# EAGLE design buffer (EAGLE 6.4)
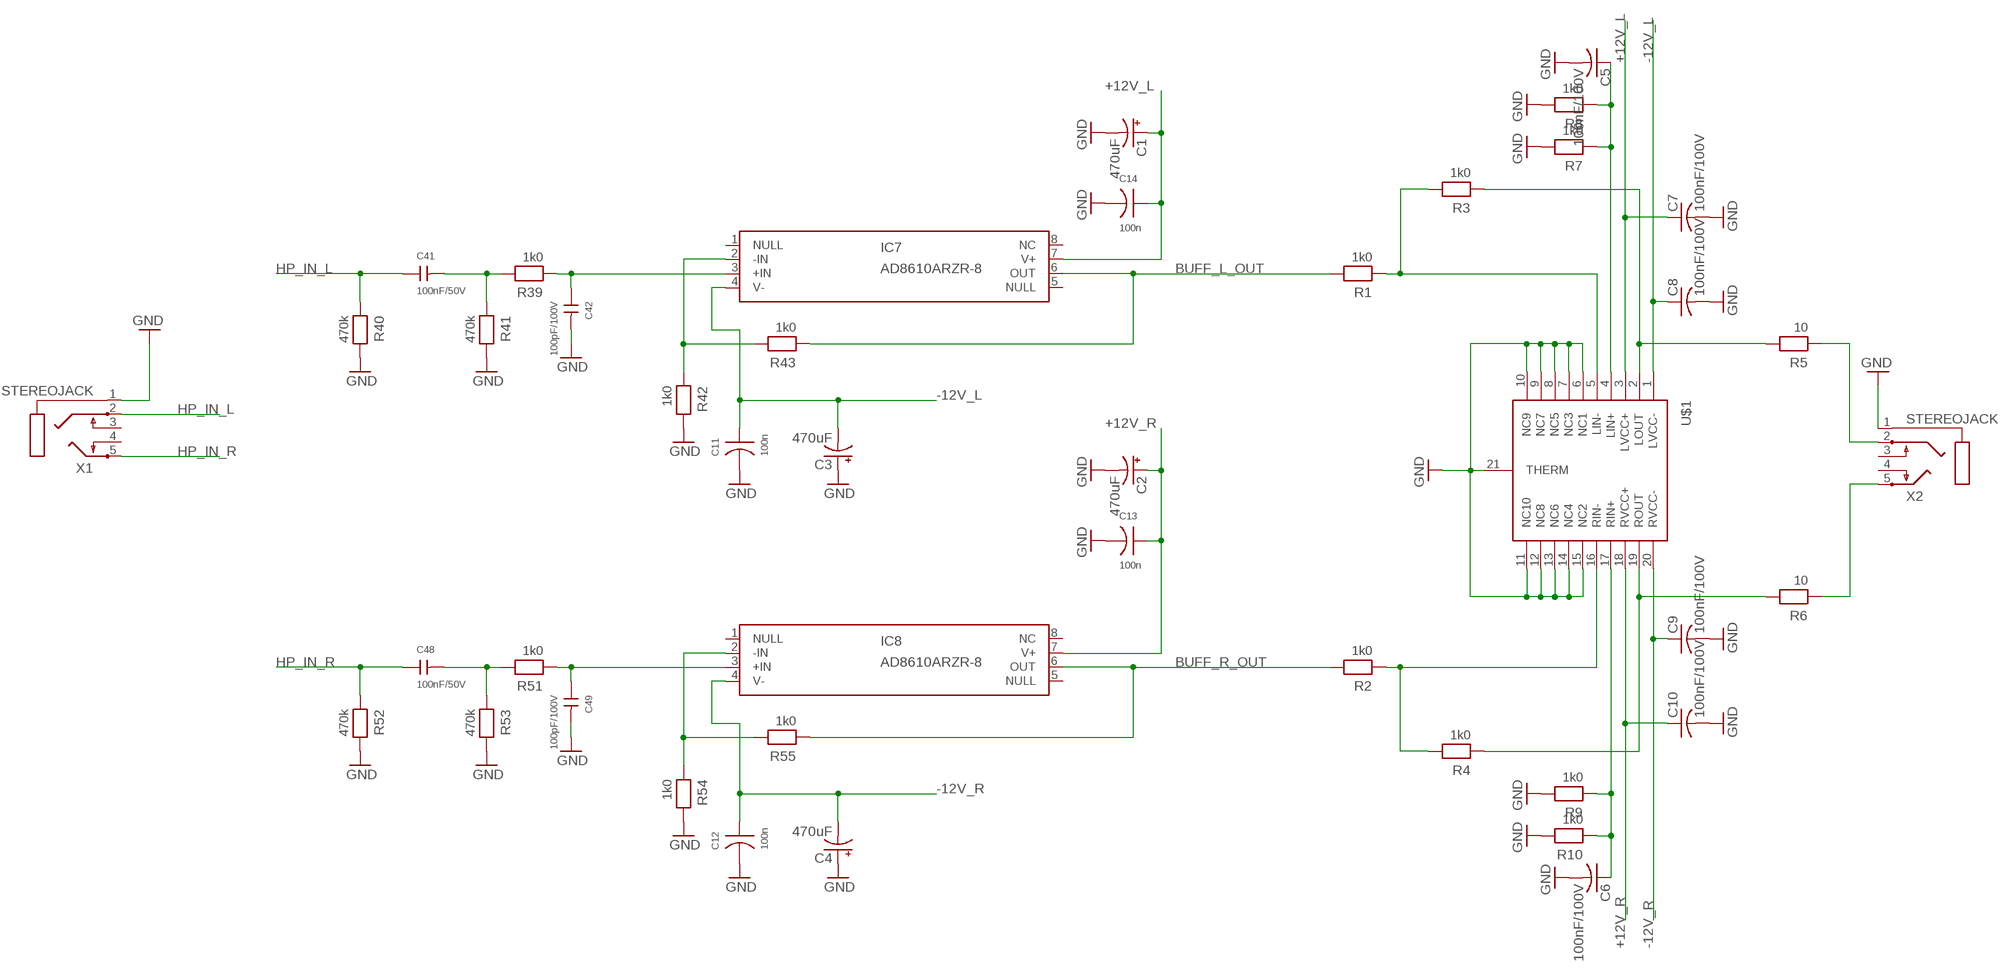
[diagram p0: schematic, sheet 1]

## Parts
C1  470uF  CPOL-USE5-13  [E5-13]
C2  470uF  CPOL-USE5-13  [E5-13]
C3  470uF  CPOL-USE5-13  [E5-13]
C4  470uF  CPOL-USE5-13  [E5-13]
C5  100nF/100V  C-USC0402  [C0402]
C6  100nF/100V  C-USC0402  [C0402]
C7  100nF/100V  C-USC0402  [C0402]
C8  100nF/100V  C-USC0402  [C0402]
C9  100nF/100V  C-USC0402  [C0402]
C10  100nF/100V  C-USC0402  [C0402]
C11  100n  PCAP0603LEVEL3  [R0603]
C12  100n  PCAP0603LEVEL3  [R0603]
C13  100n  PCAP0603LEVEL3  [R0603]
C14  100n  PCAP0603LEVEL3  [R0603]
C41  100nF/50V  100NF63VMKS2  [2,5X6,5RM5,0]
C42  100pF/100V  100PF100VFKC02  [2,5X7,0RM2,5]
C48  100nF/50V  100NF63VMKS2  [2,5X6,5RM5,0]
C49  100pF/100V  100PF100VFKC02  [2,5X7,0RM2,5]
IC7  AD8610ARZR-8  [8-LEAD-SOIC_N]
IC8  AD8610ARZR-8  [8-LEAD-SOIC_N]
R1  1k0  PRES0603LEVEL3  [R0603]
R2  1k0  PRES0603LEVEL3  [R0603]
R3  1k0  PRES0603LEVEL3  [R0603]
R4  1k0  PRES0603LEVEL3  [R0603]
R5  10  PRES0805LEVEL3  [R0805]
R6  10  PRES0805LEVEL3  [R0805]
R7  1k0  PRES0603LEVEL3  [R0603]
R8  1k0  PRES0603LEVEL3  [R0603]
R9  1k0  PRES0603LEVEL3  [R0603]
R10  1k0  PRES0603LEVEL3  [R0603]
R39  1k0  PRES0603LEVEL3  [R0603]
R40  470k  PRES0603LEVEL3  [R0603]
R41  470k  PRES0603LEVEL3  [R0603]
R42  1k0  PRES0603LEVEL3  [R0603]
R43  1k0  PRES0603LEVEL3  [R0603]
R51  1k0  PRES0603LEVEL3  [R0603]
R52  470k  PRES0603LEVEL3  [R0603]
R53  470k  PRES0603LEVEL3  [R0603]
R54  1k0  PRES0603LEVEL3  [R0603]
R55  1k0  PRES0603LEVEL3  [R0603]
U$1  TPA6120_TPA6120  [TPA6120_TPA6120]
X1  STEREOJACK  [STX3100]
X2  STEREOJACK  [STX3100]

## Nets
+12V_L: C1.+ C7.1 C14.P$2 IC7.7(V+) U$1.3(LVCC+)
+12V_R: C2.+ C10.1 C13.P$2 IC8.7(V+) U$1.18(RVCC+)
-12V_L: C3.- C8.1 C11.P$2 IC7.4(V-) U$1.1(LVCC-)
-12V_R: C4.- C9.1 C12.P$2 IC8.4(V-) U$1.20(RVCC-)
BUFF_L_OUT: IC7.6(OUT) R1.P$2 R43.P$1
BUFF_R_OUT: IC8.6(OUT) R2.P$2 R55.P$1
GND: C1.- C2.- C3.+ C4.+ C5.2 C6.2 C7.2 C8.2 C9.2 C10.2 C11.P$1 C12.P$1 C13.P$1 C14.P$1 C42.2 C49.2 R7.P$2 R8.P$2 R9.P$2 R10.P$2 R40.P$2 R41.P$2 R42.P$2 R52.P$2 R53.P$2 R54.P$2 U$1.6(NC1) U$1.7(NC3) U$1.8(NC5) U$1.9(NC7) U$1.10(NC9) U$1.11(NC10) U$1.12(NC8) U$1.13(NC6) U$1.14(NC4) U$1.15(NC2) U$1.21(THERM) X1.1 X2.1
HP_IN_L: C41.1 R40.P$1 X1.2
HP_IN_R: C48.1 R52.P$1 X1.5
INVERT_L: R1.P$1 R3.P$2 U$1.5(LIN-)
INVERT_R: R2.P$1 R4.P$2 U$1.16(RIN-)
N$19: C5.1 R7.P$1 R8.P$1 U$1.4(LIN+)
N$20: C6.1 R9.P$1 R10.P$1 U$1.17(RIN+)
N$23: R6.P$1 X2.5
N$24: R5.P$1 X2.2
N$30: C41.2 R39.P$2 R41.P$1
N$31: C42.1 IC7.3(+IN) R39.P$1
N$32: IC7.2(-IN) R42.P$1 R43.P$2
N$39: C48.2 R51.P$2 R53.P$1
N$40: C49.1 IC8.3(+IN) R51.P$1
N$41: IC8.2(-IN) R54.P$1 R55.P$2
OUT_L: R3.P$1 R5.P$2 U$1.2(LOUT)
OUT_R: R4.P$1 R6.P$2 U$1.19(ROUT)
Unconnected: IC7.1(NULL) IC7.5(NULL) IC7.8(NC) IC8.1(NULL) IC8.5(NULL) IC8.8(NC) X1.3 X1.4 X2.3 X2.4

## Library data of the parts
C1-C4 = rcl:CPOL-US: POLARIZED CAPACITOR, American symbol
C5-C10 = rcl:C-US: CAPACITOR, American symbol
C11-C14 = rcl_pro:PCAP0603
C41 C48 = wima_c:100NF63V
C42 C49 = wima_c:100PF100V
IC7 IC8 = ad8610arz:AD8610ARZ: edit this description Auto generated by make-symbol-device-package-bsdl.ulp Rev. 43 Source:
R1-R4 R7-R10 R39-R43 R51-R55 = rcl_pro:PRES0603
R5 R6 = rcl_pro:PRES0805
U$1 = amp:TPA6120_TPA6120
X1 X2 = adafruit:STEREOJACK: MIC/HEADPHONE JACK Stereo jack with two switches. Kycon STX3100, CUI SJ1-3555NG and/or 4UCon 05544

## Board
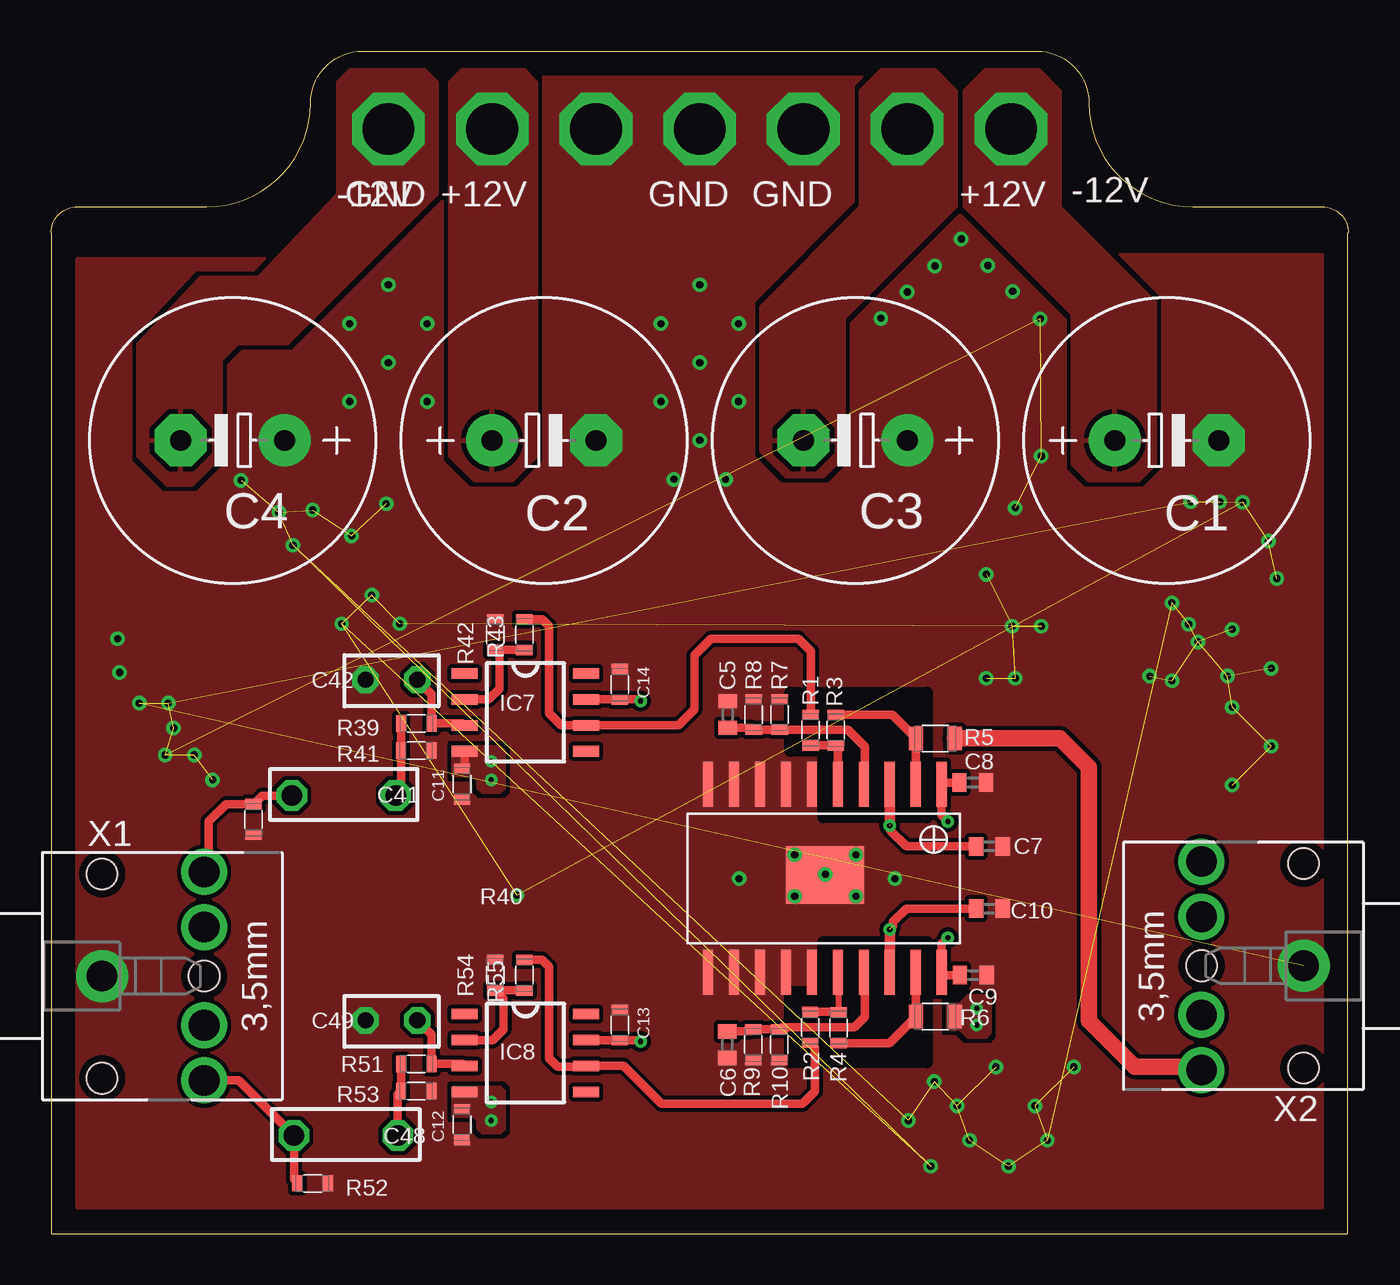
[diagram p1: board, top side]
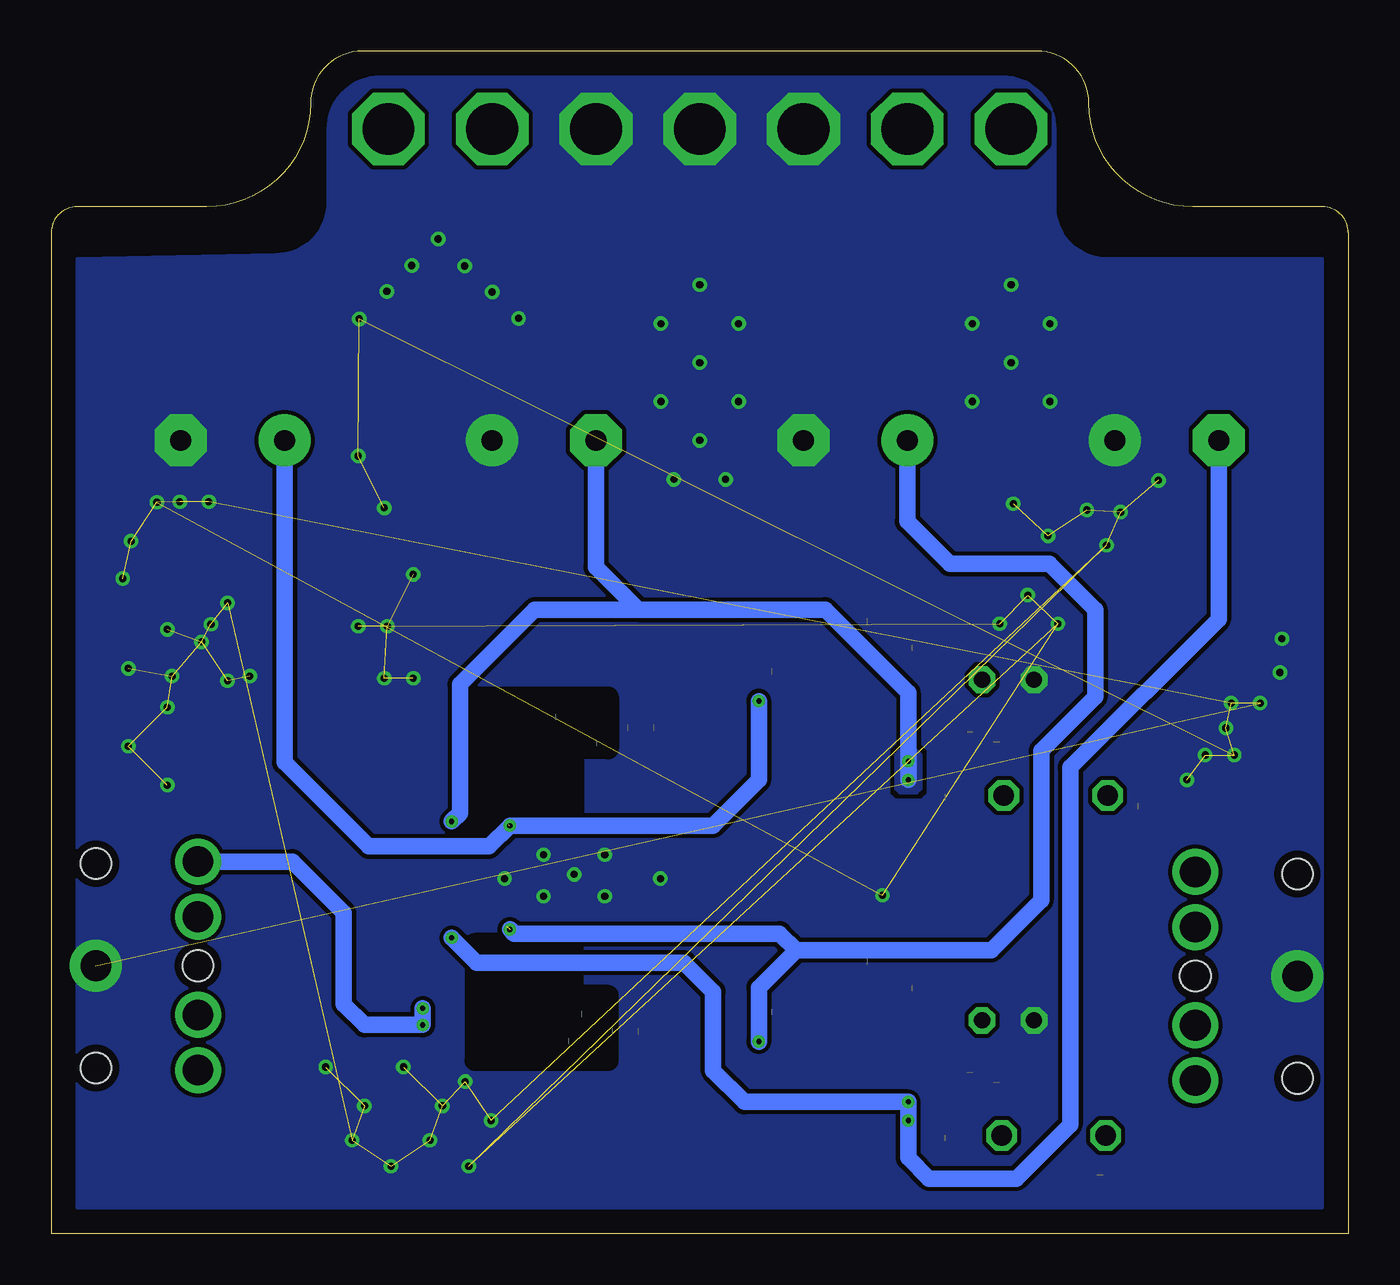
[diagram p2: board, bottom side, seen from below]

Size 63.5 x 57.86 mm. Coordinates in mm from the lower left corner, seen from the top.
Outline: 63.48,48.97 63.48,0 0,0 0,48.97 arc-90 1.27,50.24 7.62,50.24 arc90 12.7,55.32 arc-90 15.24,57.86 48.26,57.86 arc-90 50.8,55.32 arc90 55.88,50.24 62.23,50.24 arc-90 63.5,48.97
Copper layers (1*16): Top 0.0356mm / dielectric 1.5011mm / Bottom 0.0356mm
Design rules "LaenPCBOrder": minimum track width 6mil, minimum drill 13mil, track to track 6mil, track to pad 6mil, pad to pad 6mil, via to via 6mil, smd to smd 6mil, copper to edge 15mil, drill to drill 6mil, minimum pad ring 7mil, minimum via ring 7mil, stop-mask expansion 3mil, vias tented up to drill 0mil, thermal gap 10mil
tRestrict: area 36.2,20.4 to 42.9,26.5; area 36.2,8.4 to 42.9,14.3
bRestrict: area 36.2,20.5 to 42.7,26.3; area 36.2,8.5 to 42.7,14.2

### Footprints (pad centres in the part's own frame; a part is rotated, then mirrored left to right if it is on the bottom)
E5-13 = drill 1.016 pad 2.54: + -2.54,0 | drill 1.016 pad 2.54 octagon: - 2.54,0
C0402 = smd 0.7 x 0.9: 1 -0.65,0; 2 0.65,0
R0603 = smd 0.5 x 0.8: P$1 -0.75,0; P$2 0.75,0
2,5X6,5RM5,0 = drill 1 pad 1.5 octagon: 1 -2.54,0; 2 2.54,0
2,5X7,0RM2,5 = drill 0.8 pad 1.3 octagon: 1 -1.27,0; 2 1.27,0
8-LEAD-SOIC_N = smd 1.27 x 0.53: 1 -2.965,1.905; 2 -2.965,0.635; 3 -2.965,-0.635; 4 -2.965,-1.905; 5 2.965,-1.905; 6 2.965,-0.635; 7 2.965,0.635; 8 2.965,1.905
R0805 = smd 0.7 x 1.15: P$1 -0.95,0; P$2 0.95,0
TPA6120_TPA6120 = smd 0.5 x 2.2: 1 0.25,1.095; 2 1.52,1.095; 3 2.79,1.095; 4 4.06,1.095; 5 5.33,1.095; 6 6.6,1.095; 7 7.87,1.095; 8 9.14,1.095; 9 10.41,1.095; 10 11.68,1.095; 11 11.68,10.295; 12 10.41,10.295; 13 9.14,10.295; 14 7.87,10.295; 15 6.6,10.295; 16 5.33,10.295; 17 4.06,10.295; 18 2.79,10.295; 19 1.52,10.295; 20 0.25,10.295 | smd 3.81 x 2.79: 21 5.965,5.54
STX3100 = drill 1.5 pad 2.54: 1 2.7,-0.1 | drill 1.5: 2 7.7,5; 3 7.7,2.3; 4 7.7,-2.5; 5 7.7,-5.2 | hole 1.5: 2.7,4.9; 2.7,-5.1; 7.7,-0.1

### Placement (x,y rotation side)
C1  54.61,38.81 0 top
C2  24.13,38.81 0 top
C3  39.37,38.81 180 top
C4  8.89,38.81 180 top
C5  33.12,25.4 90 top
C6  33.1,9.25 270 top
C7  45.92,18.95 0 top
C8  45.11,22.07 0 top
C9  45.14,12.65 0 top
C10  45.92,15.9 0 top
C11  20.12,22 90 top
C12  20.12,5.33 90 top
C13  27.84,10.21 270 top
C14  27.84,26.87 270 top
C41  14.33,21.44 0 top
C42  16.66,27.1 180 top
C48  14.43,4.8 0 top
C49  16.66,10.44 180 top
IC7  23.22,25.5 0 top
IC8  23.22,8.84 0 top
R1  37.19,24.64 90 top
R2  37.15,10.1 270 top
R3  38.4,24.64 270 top
R4  38.54,10.07 90 top
R5  43.28,24.23 180 top
R6  43.28,10.62 180 top
R7  35.66,25.4 90 top
R8  34.39,25.4 90 top
R9  34.37,9.25 270 top
R10  35.64,9.25 270 top
R39  17.88,24.97 180 top
R40  9.91,20.27 270 top
R41  17.88,23.65 0 top
R42  21.74,29.31 90 top
R43  23.16,29.31 270 top
R51  17.88,8.31 180 top
R52  12.8,2.46 0 top
R53  17.88,6.98 0 top
R54  21.74,12.65 90 top
R55  23.16,12.65 270 top
U$1  43.84,23.09 180 top
X1  -0.2,12.7 0 top
X2  64.01,13 180 top

### Tracks (layer width: path | path; a pad name or v marks a point on that pad's centre or on a via)
+12V_L  (via drill 0.25, 2.54)  (1 unrouted)
  Top 0.406: IC7.7 27.84,26.14 | 27.84,26.14 C14.P$2 | 41.09,20.01 41.09,19.72 41.86,18.95 C7.1 | 27.84,26.14 28.78,26.14 v28.85,26.06
  Top 0.508: U$1.3 v41.05,19.97 v41.05,19.96
  Bottom 0.813: C1.+ 52.07,23.06 47.95,18.95 42.06,18.95 v41.05,19.96 31.09,19.96 28.85,22.2 v28.85,26.06
  other vias: 46.99,54.05
  pour Top (rank 5): 44.7,55.93 44.7,50.24 49.99,44.96 49.99,37.64 50.8,36.83 53.24,36.83 54.05,37.64 54.05,45.57 49.38,50.24 49.38,55.93 48.36,56.95 45.72,56.95
+12V_R  (via drill 0.25, 2.54)  (1 unrouted)
  Top 0.406: IC8.7 27.84,9.47 | 27.84,9.47 C13.P$2 | 27.84,9.47 28.78,9.47 v28.85,9.4 | 41.21,15.05 41.21,15.25 41.86,15.9 C10.1
  Top 0.508: U$1.18 v41.05,14.88
  Bottom 0.813: v41.05,14.88 40.84,14.68 27.84,14.68 27.03,13.87 | C2.+ 21.59,34.85 19.51,32.77 14.63,32.77 12.39,30.53 12.39,26.26 15.04,23.62 15.04,16.31 17.47,13.87 27.03,13.87 | 27.03,13.87 28.85,12.04 v28.85,9.4
  other vias: 21.59,54.05
  pour Top (rank 5): 19.51,38.46 19.51,56.34 20.12,56.95 23.16,56.95 23.77,56.34 23.77,38.05 22.56,36.83 20.73,36.83 19.51,38.05
-12V_L  (via drill 0.25, 2.54)
  Top 0.406: C8.1 43.59,22.07 U$1.1 43.59,20.47 v43.89,20.17 | IC7.4 20.25,22.88 C11.P$2
  Bottom 0.813: C3.- 36.83,32.61 34.75,30.53 | 34.75,30.53 25.6,30.53 21.54,26.47 v21.54,22.2 | 34.75,30.53 39.83,30.53 43.48,26.87 43.48,20.57 v43.89,20.17
  other vias: 41.91,54.05 21.54,23.11
  pour Top (rank 5): 44.3,55.93 44.3,50.24 38.81,44.75 38.81,38.05 37.8,37.03 35.97,37.03 34.75,38.25 34.75,45.36 39.62,50.24 39.62,55.93 40.64,56.95 43.28,56.95
  pour Top (no thermals): 19.71,23.83 21.95,23.83 22.15,23.62 22.15,21.79 21.95,21.59 21.13,21.59 20.93,21.79 20.93,22.2 20.73,22.4 19.71,22.4
  pour Bottom (no thermals): 20.93,23.42 21.13,23.62 21.95,23.62 22.15,23.42 22.15,21.79 21.95,21.59 21.13,21.59 20.93,21.79
-12V_R  (via drill 0.25, 2.54)
  Top 0.406: C9.1 43.59,12.65 U$1.20 43.59,14.18 v43.89,14.48
  Bottom 0.813: C4.- 6.35,30.07 13.61,22.81 13.61,5.33 16.26,2.69 20.52,2.69 21.54,3.71 v21.54,6.45 29.57,6.45 31.09,7.98 31.09,11.84 32.51,13.26 42.67,13.26 v43.89,14.48
  other vias: 16.51,54.05 21.54,5.54
  pour Top (rank 5): 18.29,56.95 14.63,56.95 14.02,56.34 14.02,50.85 10.16,46.79 7.32,46.79 4.27,43.54 4.27,38.05 5.69,36.63 6.91,36.63 8.33,38.05 8.33,42.72 9.14,43.54 11.58,43.54 18.9,50.85 18.9,56.34
  pour Top (no thermals): 19.71,7.16 21.95,7.16 22.15,6.96 22.15,5.13 21.95,4.93 21.13,4.93 20.93,5.13 20.93,5.54 20.73,5.74 19.71,5.74
BUFF_L_OUT
  Top 0.406: R43.P$1 24.04,30.06 24.38,29.72 24.38,25.45 24.97,24.87 IC7.6 30.71,24.87 31.5,25.65 31.5,28.3 32.31,29.11 36.58,29.11 37.19,28.5 R1.P$2
BUFF_R_OUT
  Top 0.406: R2.P$2 37.39,9.11 37.39,6.96 36.78,6.35 29.87,6.35 28.02,8.2 IC8.6 26.16,8.18 24.79,8.18 24.38,8.59 24.38,13.06 24.04,13.4 R55.P$1
GND  (via drill 0.35, 2.54)  (50 unrouted)
  other vias: 36.4,16.51 39.4,16.51 41.3,17.37 39.4,18.54 36.4,18.54 16.51,46.43 18.42,44.53 14.61,44.53 16.51,42.62 18.42,40.72 14.61,40.72 33.68,17.37 47.19,35.51 48.46,38.05 48.41,44.75 5.59,23.42 4.32,25.96 55.78,35.81 45.77,27.18 47.04,29.72 45.77,32.26 7.01,23.42 5.74,25.96 57.2,35.81 47.19,27.18 48.46,29.72 44.55,48.67 45.85,47.37 47.07,46.1 41.91,46.08 40.61,44.78 43.26,47.35 31.75,46.43 33.66,44.53 31.75,42.62 33.66,40.72 29.84,44.53 29.84,40.72 31.75,38.81 33.02,36.91 30.48,36.91 15.7,31.24 14.22,29.84 17.07,29.84 22.81,16.56 58.32,35.79 59.59,33.88 3.25,29.11 3.35,27.46 9.3,36.86 11.84,33.68 43.05,3.3 44.96,4.57 46.86,3.3 48.77,4.57 54.86,30.86 56.13,28.96 54.86,27.05 43.23,7.44 41.96,5.54 14.71,34.14 12.8,35.41 16.41,35.71 11.15,35.31 57.81,21.95 59.72,23.85 57.81,25.76 59.72,27.66 57.81,29.57 50.06,8.15 48.16,6.25 46.25,8.15 44.35,6.25 57.58,27.28 53.77,27.28 55.68,29.82 59.99,32.05 7.9,22.2 5.99,24.74 37.9,17.58 26.67,54.05 31.75,54.05 36.83,54.05
  pour Bottom (isolate 0.203, rank 6, no thermals): 1.27,47.7 11.84,47.7 arc90 14.38,50.24 14.38,54.05 arc-90 16.92,56.59 47.4,56.59 arc-90 49.94,54.05 49.94,50.44 arc90 52.48,47.9 62.23,47.7 62.23,1.27 1.27,1.27
  pour Top (isolate 0.203, rank 6, no thermals): 1.27,47.7 11.84,47.7 arc90 14.38,50.24 14.38,54.05 arc-90 16.92,56.59 47.19,56.59 arc-90 49.94,54.05 49.94,50.44 arc90 52.48,47.9 62.23,47.9 62.23,1.27 1.27,1.27
HP_IN_L
  Top 0.406: C41.1 10.32,21.44 R40.P$1 8.57,21.02 7.72,20.17 7.72,17.93 X1.2
HP_IN_R
  Top 0.406: R52.P$1 11.89,2.63 C48.1 9.19,7.5 X1.5
INVERT_L
  Top 0.305: 37.1,24.01 R1.P$1
  Top 0.406: U$1.5 38.51,23.78 R3.P$2 R1.P$1
INVERT_R
  Top 0.178: 38.54,12.76 U$1.16
  Top 0.305: 38.54,12.76 R4.P$2
  Top 0.406: R4.P$2 38.54,10.85 R2.P$1
N$19
  Top 0.406: U$1.4 39.83,22.04 39.83,23.83 39,24.65 R7.P$1 R8.P$1 34.29,24.75 C5.1
N$20
  Top 0.406: U$1.17 39.83,12.75 39.83,10.62 39.32,10.11 35.76,10.11 R10.P$1 R9.P$1 34.27,9.9 C6.1
N$23  (via drill 0.25)
  Bottom 0.813: X2.5 51.68,18.21 49.17,15.7 49.17,11.23 48.16,10.21 v45.31,10.21 v45.31,11.02
  pour Top (no thermals): 43.89,11.23 44.5,11.23 44.91,11.63 45.72,11.63 45.92,11.43 45.92,9.8 45.72,9.6 44.91,9.6 44.5,10.01 43.89,10.01
N$24
  Top 0.813: R5.P$1 49.38,24.23 50.8,22.81 50.8,10.41 53.04,8.18 56.13,8.18 X2.2
N$30
  Top 0.406: C41.2 17.13,21.7 R41.P$1 R39.P$2
N$31
  Top 0.406: C42.1 18.63,26.4 R39.P$1 20.15,24.97 IC7.3
N$32
  Top 0.406: IC7.2 21.41,26.14 21.95,26.67 21.95,28.36 R42.P$1 R43.P$2
N$39
  Top 0.406: C48.2 16.97,6.82 R53.P$1 R51.P$2
N$40
  Top 0.406: IC8.3 20.15,8.31 R51.P$1 18.63,9.74 C49.1
N$41
  Top 0.406: IC8.2 21.61,9.47 22.15,10.01 22.15,11.49 R54.P$1 R55.P$2
OUT_L
  Top 0.406: U$1.2 42.32,24.22 R5.P$2 41.17,25.39 R3.P$1
OUT_R
  Top 0.406: U$1.19 42.32,10.83 R6.P$2 41.03,9.32 R4.P$1

### Text on the board
tPlace: -12V | GND | +12V | GND | GND | +12V | -12V